# EAGLE design SparkFun_OpAmp_Breakout-LMV358 (EAGLE 7.2.0)
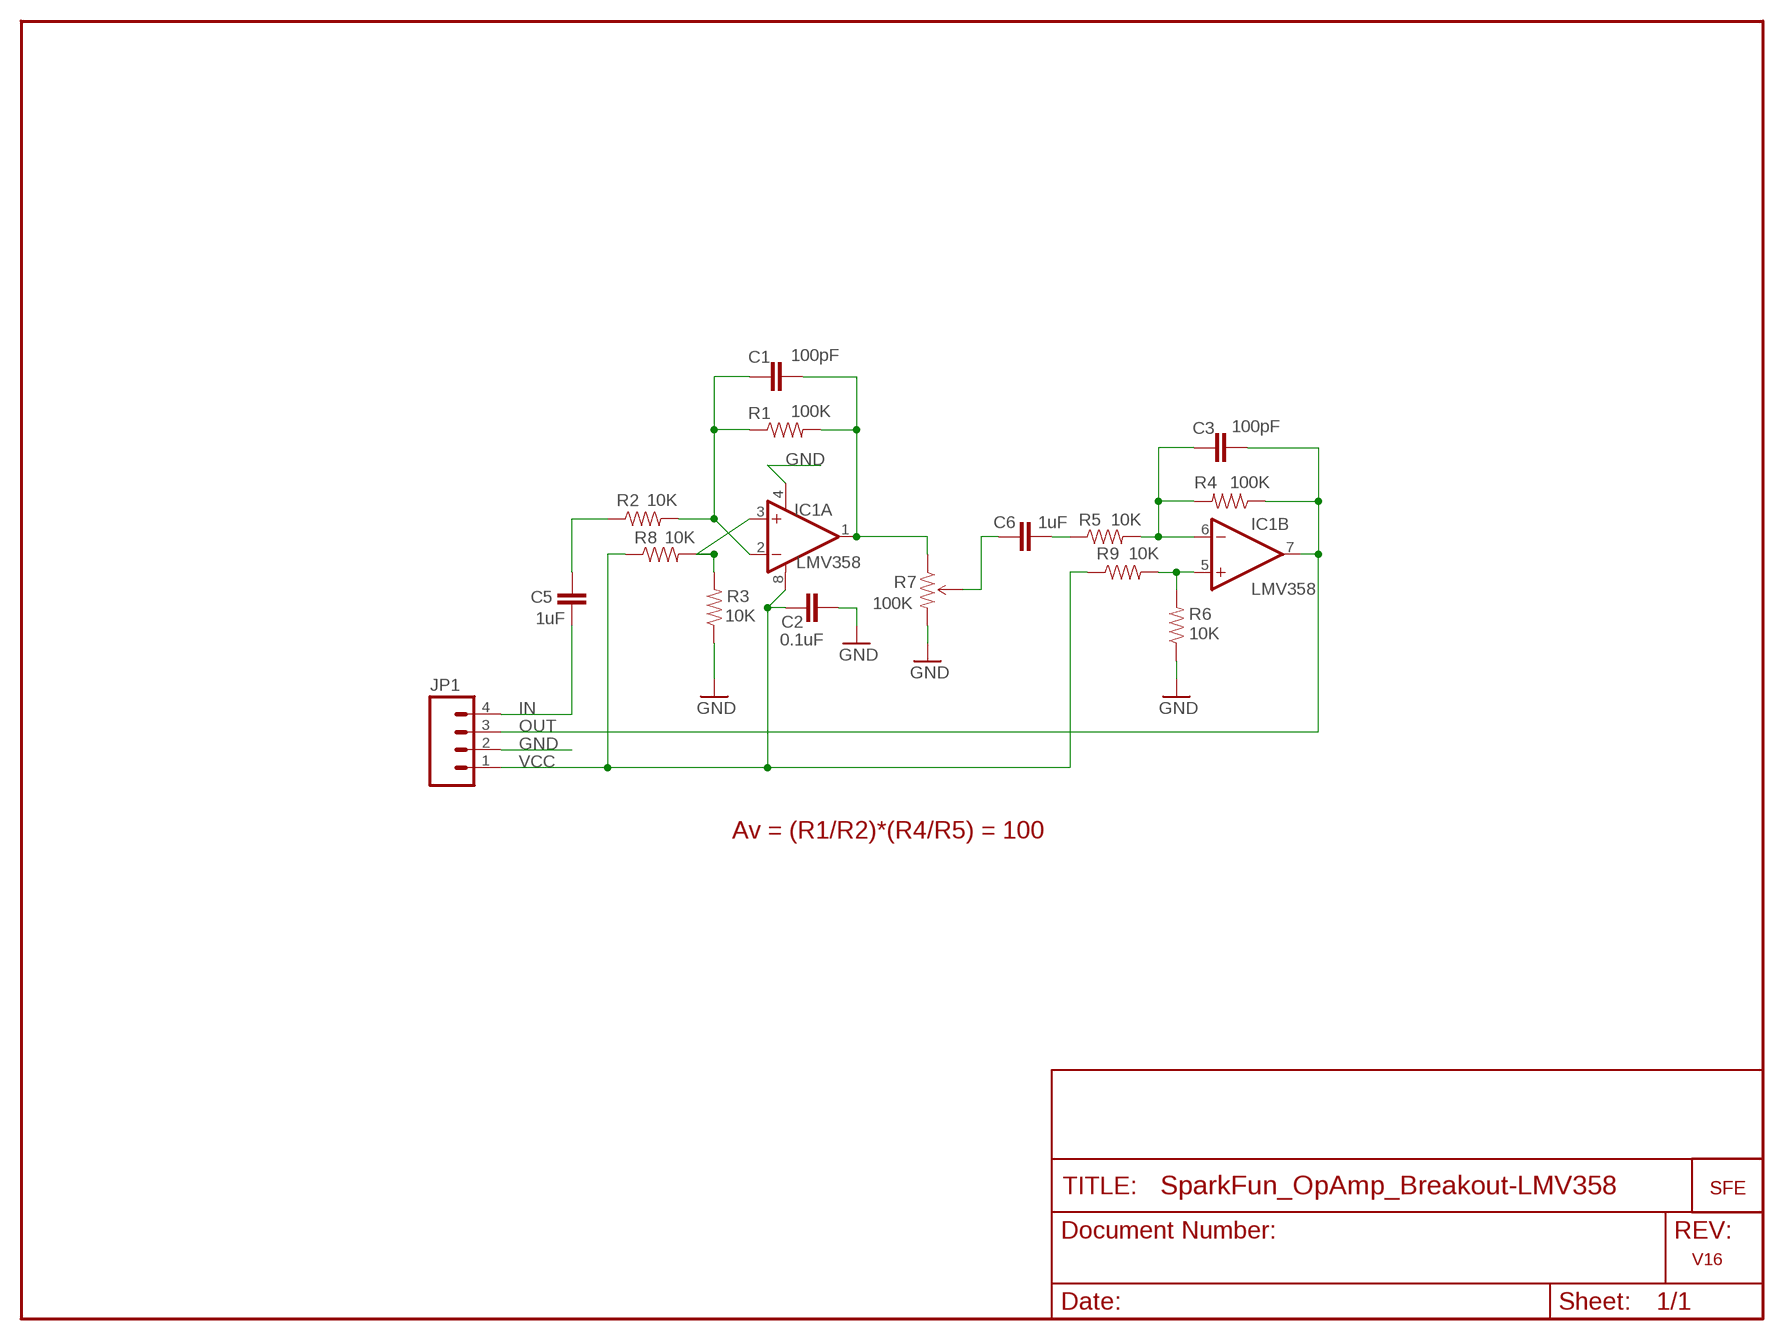
[diagram p0: schematic, sheet 1]

## Parts
C1  100pF  CAP0402-CAP  [0402-CAP]
C2  0.1uF  CAP0402-CAP  [0402-CAP]
C3  100pF  CAP0402-CAP  [0402-CAP]
C5  1uF  CAP0402-CAP  [0402-CAP]
C6  1uF  CAP0402-CAP  [0402-CAP]
IC1  LMV358  OPAMP-DUALU  [SO08]
JP1  M04PTH  [1X04]
R1  100K  RESISTOR0402-RES  [0402-RES]
R2  10K  RESISTOR0402-RES  [0402-RES]
R3  10K  RESISTOR0402-RES  [0402-RES]
R4  100K  RESISTOR0402-RES  [0402-RES]
R5  10K  RESISTOR0402-RES  [0402-RES]
R6  10K  RESISTOR0402-RES  [0402-RES]
R7  100K  TRIMPOTSMD  [TRIMPOT-3MM]
R8  10K  RESISTOR0402  [C0402]
R9  10K  RESISTOR0402  [C0402]
U$3  LOGO-SFENEW  [SFE-NEW-WEBLOGO]

## Nets
GND: C2.2 IC1.4(A:V-) JP1.2 R3.1 R6.1 R7.3(CW)
IN: C5.1 JP1.4
IN1: C5.2 R2.1
N$1: IC1.5(B:+IN) R6.2 R9.2
N$2: C1.1 IC1.2(A:-IN) R1.1 R2.2
N$3: IC1.3(A:+IN) R3.2 R8.2
N$4: C6.1 R5.1
N$5: C6.2 R7.2(WIPER)
N$7: C3.1 IC1.6(B:-IN) R4.2 R5.2
OUT: C3.2 IC1.7(B:OUT) JP1.3 R4.1
OUT1: C1.2 IC1.1(A:OUT) R1.2 R7.1(CCW)
VCC: C2.1 IC1.8(A:V+) JP1.1 R8.1 R9.1

## Notes on the sheet
- Av = (R1/R2)*(R4/R5) = 100
- V16

## Library data of the parts
C1-C3 C5 C6 = SparkFun:CAP: Capacitor Standard 0603 ceramic capacitor, and 0.1" leaded capacitor.
IC1 = SparkFun:OPAMP-DUAL: Operational Amplifier
JP1 = SparkFun:M04: Header 4 Standard 4-pin 0.1" header. Use with straight break away headers (SKU : PRT-00116), right angle break away headers (PRT-00553), swiss pins (PRT-00743), machine pins (PRT-00117), and female headers (PRT-00115). Molex polarized connector foot print use with SKU : PRT-08231 with associated crimp pins and housings. 1MM SMD Version SKU: PRT-10208
R1-R6 = SparkFun:RESISTOR: Resistor
R7 = SparkFun:TRIMPOT
R8 R9 = SparkFun-DC:RESISTOR: Resistor
U$3 = SparkFun:LOGO-SFE: Spark Fun Electronics PCB Logo This is the standard Spark Fun Electronics PCB logo.

## Board
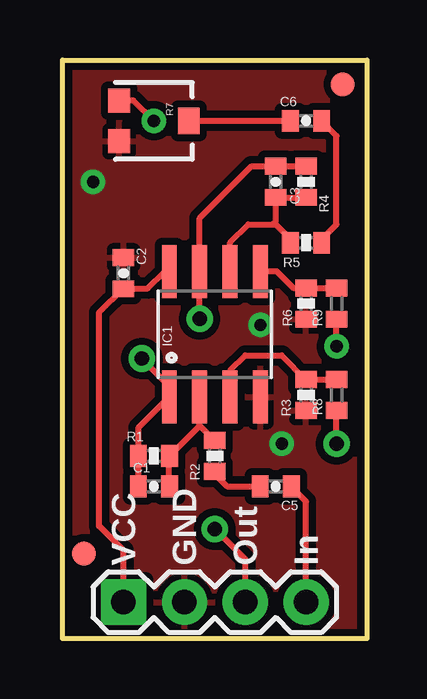
[diagram p1: board, top side]
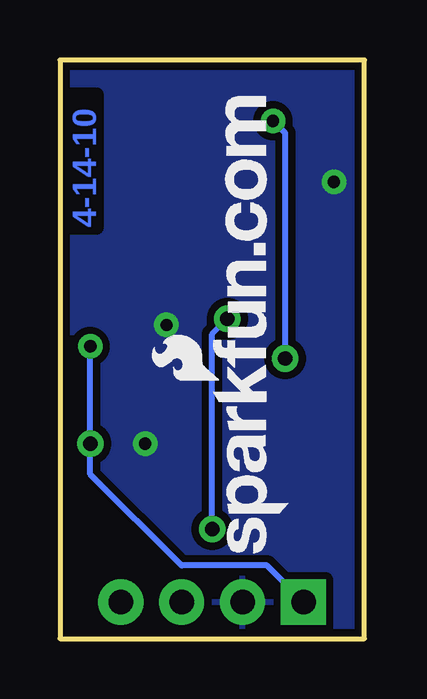
[diagram p2: board, bottom side, seen from below]

Size 12.7 x 24.13 mm. Coordinates in mm from the lower left corner, seen from the top.
Outline: 0,0 0,24.13 12.7,24.13 12.7,0 0,0
Copper layers (1*16): Top 0.035mm / dielectric 1.5mm / Bottom 0.035mm
Design rules "SparkFun": minimum track width 8mil, minimum drill 20mil, track to track 8mil, track to pad 8mil, pad to pad 8mil, via to via 8mil, smd to smd 8mil, copper to edge 10mil, drill to drill 8mil, minimum pad ring 12mil, minimum via ring 10mil, stop-mask expansion 4mil, vias tented up to drill 25mil, thermal gap 10mil

### Footprints (pad centres in the part's own frame; a part is rotated, then mirrored left to right if it is on the bottom)
0402-CAP = smd 0.7 x 0.9: 1 -0.65,0; 2 0.65,0
FIDUCIAL-1X2 = smd 1 x 1: 1 0,0
SO08 = smd 0.61 x 2.21: 1 -1.905,-2.616; 2 -0.635,-2.616; 3 0.635,-2.616; 4 1.905,-2.616; 5 1.905,2.616; 6 0.635,2.616; 7 -0.635,2.616; 8 -1.905,2.616
1X04 = drill 1.016 pad 1.88 square: 1 0,0 | drill 1.016 pad 1.88: 2 2.54,0; 3 5.08,0; 4 7.62,0
0402-RES = smd 0.7 x 0.9: 1 -0.65,0; 2 0.65,0
TRIMPOT-3MM = smd 1 x 0.9: 1 -0.85,-1.45; 3 0.85,-1.45 | smd 1.1 x 0.9: 2 0,1.45
C0402 = smd 0.7 x 0.9: 1 -0.65,0; 2 0.65,0

### Placement (x,y rotation side)
C1  3.81,6.35 180 top
C2  2.54,15.24 90 top
C3  8.89,19.05 90 top
C5  8.89,6.35 180 top
C6  10.16,21.59 180 top
E$1  [FIDUCIAL-1X2]  11.68,23.11 0 top
E$2  [FIDUCIAL-1X2]  0.89,3.56 0 top
IC1  6.35,12.7 0 top
JP1  2.54,1.52 0 top
R1  3.81,7.62 180 top
R2  6.35,7.62 90 top
R3  10.16,10.16 90 top
R4  10.16,19.05 270 top
R5  10.16,16.51 180 top
R6  10.16,13.97 90 top
R7  3.81,21.59 270 top
R8  11.43,10.16 90 top
R9  11.43,13.97 90 top
U$3  3.17,3.57 90 bottom

### Tracks (layer width: path | path; a pad name or v marks a point on that pad's centre or on a via)
GND  (via drill 0.51)
  other vias: 1.27,19.05 8.26,13.08 9.14,8.13
  pour Top (isolate 0.305): 0,0 12.7,0 12.7,24.13 0,24.13
  pour Bottom (isolate 0.305): 0,0 12.7,0 12.7,24.13 0,24.13
  pour Bottom (isolate 0.305): 0,0 0,24.13 12.7,24.13 12.7,0
IN
  Top 0.254: C5.1 9.53,6.35 10.16,5.71 JP1.4
IN1
  Top 0.254: R2.1 6.35,6.86 6.86,6.35 C5.2
N$1
  Top 0.254: R6.2 10.05,14.62 10.03,14.61 | R6.2 R9.2 | IC1.5 8.94,15.32 9.65,14.61 9.91,14.61 10.03,14.73 10.14,14.62 R6.2
N$2
  Top 0.254: 6.06,8.17 R2.2 6.35,8.26 5.71,8.89 | 5.71,8.89 IC1.2 | 5.71,8.89 5.71,8.88 R1.1 4.45,7.62 4.45,6.37 C1.1
N$3
  Top 0.254: R3.2 10.05,10.81 10.03,10.79 | R3.2 R8.2 | IC1.3 6.99,11.18 7.62,11.81 9.14,11.81 10.16,10.79 R3.2
N$4
  Top 0.254: R5.1 10.81,16.65 11.43,17.27 11.43,20.95 10.79,21.59 C6.1
N$5
  Top 0.254: R7.2 C6.2
N$7
  Top 0.254: IC1.6 6.99,16.51 7.75,17.27 8.76,17.27 | R5.2 9.51,16.62 9.53,16.64 8.89,17.27 8.76,17.27 | 8.76,17.27 8.89,17.4 C3.1 10.14,18.4 10.16,18.41 R4.2
OUT  (via drill 0.6)
  Top 0.254: R4.1 8.9,19.7 8.89,19.68 C3.2 7.89,19.7 5.71,17.53 IC1.7 v5.71,13.34 | JP1.3 7.62,3.3 v6.35,4.57
  Bottom 0.254: v6.35,4.57 6.35,12.7 v5.71,13.34
OUT1  (via drill 0.51, 0.6)
  Top 0.254: C1.2 3.17,6.35 3.17,7.61 R1.2 3.17,7.62 3.17,8.81 IC1.1 4.45,10.54 v3.3,11.68 | v3.81,21.59 2.96,22.44 R7.1
  Bottom 0.254: v3.3,11.68 3.3,21.08 v3.81,21.59
VCC  (via drill 0.51, 0.6)
  Top 0.254: 11.43,13.21 11.36,13.21 R9.1 | v11.43,8.13 11.43,9.65 11.36,9.65 R8.1 | JP1.1 2.54,3.68 1.52,4.7 1.52,13.59 2.54,14.61 | IC1.8 4.27,15.32 3.56,14.61 2.54,14.61 | 2.54,14.61 C2.1 | R9.1 11.43,13.34 | v11.43,12.19 R9.1
  Bottom 0.254: JP1.1 4.06,3.05 7.62,3.05 11.43,6.86 v11.43,8.13 v11.43,12.19

### Text on the board
Bottom: 4-14-10
tPlace: VCC | GND | Out | In
tValues: 100K trimpot | LMV358